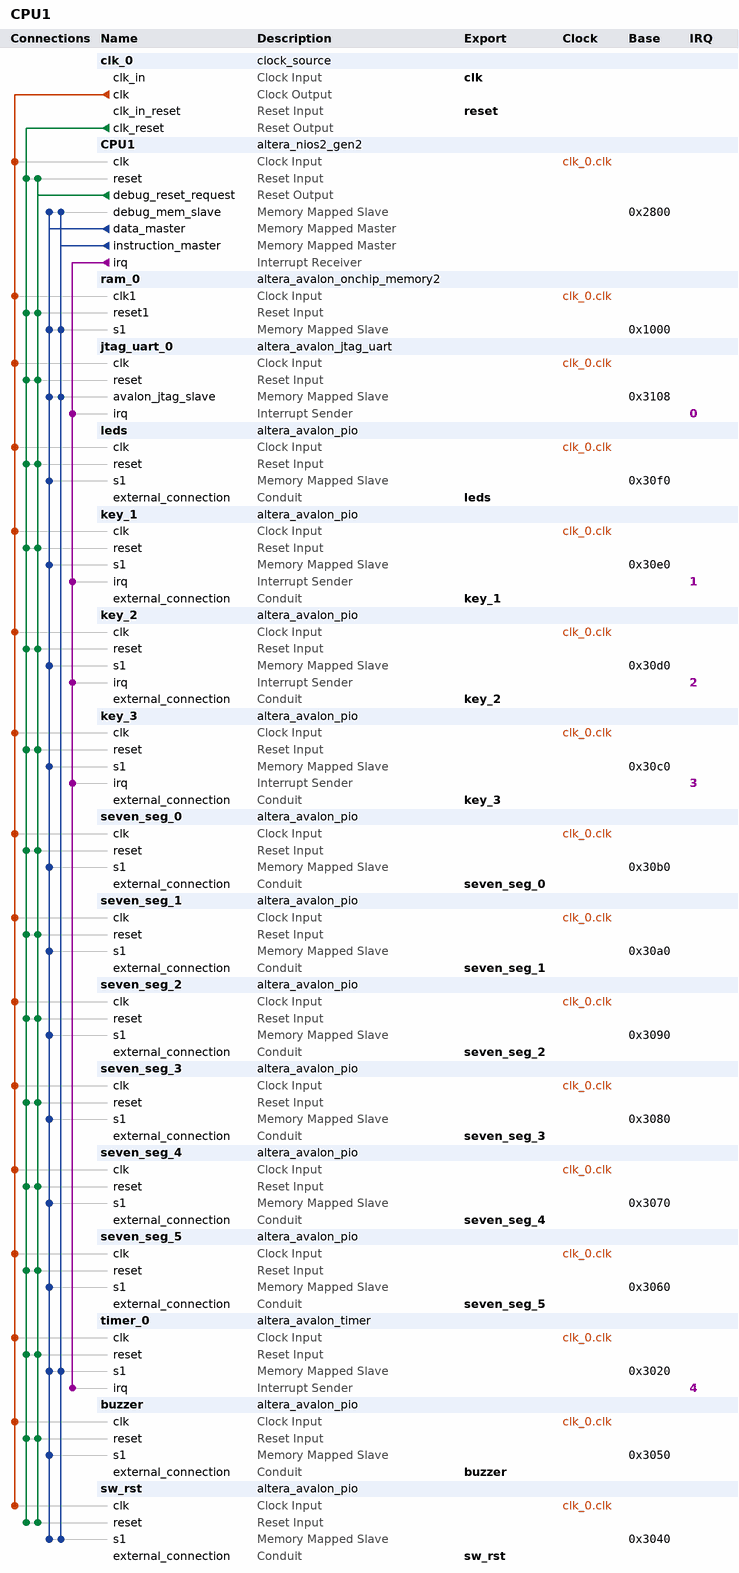
[diagram p0: system contents]
# Platform Designer (Qsys) system CPU1, Cyclone V 5CSXFC6D6F31C6
# Parameters at their usual value, and those the tool derives, are not listed.
package require -exact qsys 18.1
create_system CPU1
set_project_property DEVICE_FAMILY {Cyclone V}
set_project_property DEVICE 5CSXFC6D6F31C6

add_instance clk_0 clock_source 18.1
set_instance_parameter_value clk_0 clockFrequency 50000000

add_instance CPU1 altera_nios2_gen2 18.1
set_instance_parameter_value CPU1 dcache_size 2048
set_instance_parameter_value CPU1 exceptionSlave ram_0.s1
set_instance_parameter_value CPU1 icache_size 4096
set_instance_parameter_value CPU1 impl Tiny
set_instance_parameter_value CPU1 resetSlave ram_0.s1

add_instance ram_0 altera_avalon_onchip_memory2 18.1
set_instance_parameter_value ram_0 dataWidth 32
set_instance_parameter_value ram_0 dualPort false
set_instance_parameter_value ram_0 initMemContent true
set_instance_parameter_value ram_0 initializationFileName onchip_mem.hex
set_instance_parameter_value ram_0 memorySize 4090

add_instance jtag_uart_0 altera_avalon_jtag_uart 18.1
set_instance_parameter_value jtag_uart_0 simInteractiveOptions NO_INTERACTIVE_WINDOWS

add_instance leds altera_avalon_pio 18.1
set_instance_parameter_value leds direction Output
set_instance_parameter_value leds width 10

add_instance key_1 altera_avalon_pio 18.1
set_instance_parameter_value key_1 captureEdge true
set_instance_parameter_value key_1 direction Input
set_instance_parameter_value key_1 edgeType FALLING
set_instance_parameter_value key_1 generateIRQ true
set_instance_parameter_value key_1 width 1

add_instance key_2 altera_avalon_pio 18.1
set_instance_parameter_value key_2 captureEdge true
set_instance_parameter_value key_2 direction Input
set_instance_parameter_value key_2 edgeType FALLING
set_instance_parameter_value key_2 generateIRQ true
set_instance_parameter_value key_2 width 1

add_instance key_3 altera_avalon_pio 18.1
set_instance_parameter_value key_3 captureEdge true
set_instance_parameter_value key_3 direction Input
set_instance_parameter_value key_3 edgeType FALLING
set_instance_parameter_value key_3 generateIRQ true
set_instance_parameter_value key_3 width 1

add_instance seven_seg_0 altera_avalon_pio 18.1
set_instance_parameter_value seven_seg_0 direction Output
set_instance_parameter_value seven_seg_0 width 7

add_instance seven_seg_1 altera_avalon_pio 18.1
set_instance_parameter_value seven_seg_1 direction Output
set_instance_parameter_value seven_seg_1 width 7

add_instance seven_seg_2 altera_avalon_pio 18.1
set_instance_parameter_value seven_seg_2 direction Output
set_instance_parameter_value seven_seg_2 width 7

add_instance seven_seg_3 altera_avalon_pio 18.1
set_instance_parameter_value seven_seg_3 direction Output
set_instance_parameter_value seven_seg_3 width 7

add_instance seven_seg_4 altera_avalon_pio 18.1
set_instance_parameter_value seven_seg_4 direction Output
set_instance_parameter_value seven_seg_4 width 7

add_instance seven_seg_5 altera_avalon_pio 18.1
set_instance_parameter_value seven_seg_5 direction Output
set_instance_parameter_value seven_seg_5 width 7

add_instance timer_0 altera_avalon_timer 18.1
set_instance_parameter_value timer_0 alwaysRun true
set_instance_parameter_value timer_0 fixedPeriod true
set_instance_parameter_value timer_0 period 1
set_instance_parameter_value timer_0 periodUnits MSEC
set_instance_parameter_value timer_0 snapshot false

add_instance buzzer altera_avalon_pio 18.1
set_instance_parameter_value buzzer direction Output
set_instance_parameter_value buzzer width 1

add_instance sw_rst altera_avalon_pio 18.1
set_instance_parameter_value sw_rst direction Input
set_instance_parameter_value sw_rst width 1

# connections
add_connection clk_0.clk buzzer.clk clock
add_connection clk_0.clk CPU1.clk clock
add_connection clk_0.clk jtag_uart_0.clk clock
add_connection clk_0.clk key_1.clk clock
add_connection clk_0.clk key_2.clk clock
add_connection clk_0.clk key_3.clk clock
add_connection clk_0.clk leds.clk clock
add_connection clk_0.clk ram_0.clk1 clock
add_connection clk_0.clk seven_seg_0.clk clock
add_connection clk_0.clk seven_seg_1.clk clock
add_connection clk_0.clk seven_seg_2.clk clock
add_connection clk_0.clk seven_seg_3.clk clock
add_connection clk_0.clk seven_seg_4.clk clock
add_connection clk_0.clk seven_seg_5.clk clock
add_connection clk_0.clk sw_rst.clk clock
add_connection clk_0.clk timer_0.clk clock
add_connection clk_0.clk_reset buzzer.reset reset
add_connection clk_0.clk_reset CPU1.reset reset
add_connection clk_0.clk_reset jtag_uart_0.reset reset
add_connection clk_0.clk_reset key_1.reset reset
add_connection clk_0.clk_reset key_2.reset reset
add_connection clk_0.clk_reset key_3.reset reset
add_connection clk_0.clk_reset leds.reset reset
add_connection clk_0.clk_reset ram_0.reset1 reset
add_connection clk_0.clk_reset seven_seg_0.reset reset
add_connection clk_0.clk_reset seven_seg_1.reset reset
add_connection clk_0.clk_reset seven_seg_2.reset reset
add_connection clk_0.clk_reset seven_seg_3.reset reset
add_connection clk_0.clk_reset seven_seg_4.reset reset
add_connection clk_0.clk_reset seven_seg_5.reset reset
add_connection clk_0.clk_reset sw_rst.reset reset
add_connection clk_0.clk_reset timer_0.reset reset
add_connection CPU1.debug_reset_request buzzer.reset reset
add_connection CPU1.debug_reset_request CPU1.reset reset
add_connection CPU1.debug_reset_request jtag_uart_0.reset reset
add_connection CPU1.debug_reset_request key_1.reset reset
add_connection CPU1.debug_reset_request key_2.reset reset
add_connection CPU1.debug_reset_request key_3.reset reset
add_connection CPU1.debug_reset_request leds.reset reset
add_connection CPU1.debug_reset_request ram_0.reset1 reset
add_connection CPU1.debug_reset_request seven_seg_0.reset reset
add_connection CPU1.debug_reset_request seven_seg_1.reset reset
add_connection CPU1.debug_reset_request seven_seg_2.reset reset
add_connection CPU1.debug_reset_request seven_seg_3.reset reset
add_connection CPU1.debug_reset_request seven_seg_4.reset reset
add_connection CPU1.debug_reset_request seven_seg_5.reset reset
add_connection CPU1.debug_reset_request sw_rst.reset reset
add_connection CPU1.debug_reset_request timer_0.reset reset
add_connection CPU1.data_master buzzer.s1 avalon
set_connection_parameter_value CPU1.data_master/buzzer.s1 baseAddress 0x3050
add_connection CPU1.data_master CPU1.debug_mem_slave avalon
set_connection_parameter_value CPU1.data_master/CPU1.debug_mem_slave baseAddress 0x2800
add_connection CPU1.data_master jtag_uart_0.avalon_jtag_slave avalon
set_connection_parameter_value CPU1.data_master/jtag_uart_0.avalon_jtag_slave baseAddress 0x3108
add_connection CPU1.data_master key_1.s1 avalon
set_connection_parameter_value CPU1.data_master/key_1.s1 baseAddress 0x30e0
add_connection CPU1.data_master key_2.s1 avalon
set_connection_parameter_value CPU1.data_master/key_2.s1 baseAddress 0x30d0
add_connection CPU1.data_master key_3.s1 avalon
set_connection_parameter_value CPU1.data_master/key_3.s1 baseAddress 0x30c0
add_connection CPU1.data_master leds.s1 avalon
set_connection_parameter_value CPU1.data_master/leds.s1 baseAddress 0x30f0
add_connection CPU1.data_master ram_0.s1 avalon
set_connection_parameter_value CPU1.data_master/ram_0.s1 baseAddress 0x1000
add_connection CPU1.data_master seven_seg_0.s1 avalon
set_connection_parameter_value CPU1.data_master/seven_seg_0.s1 baseAddress 0x30b0
add_connection CPU1.data_master seven_seg_1.s1 avalon
set_connection_parameter_value CPU1.data_master/seven_seg_1.s1 baseAddress 0x30a0
add_connection CPU1.data_master seven_seg_2.s1 avalon
set_connection_parameter_value CPU1.data_master/seven_seg_2.s1 baseAddress 0x3090
add_connection CPU1.data_master seven_seg_3.s1 avalon
set_connection_parameter_value CPU1.data_master/seven_seg_3.s1 baseAddress 0x3080
add_connection CPU1.data_master seven_seg_4.s1 avalon
set_connection_parameter_value CPU1.data_master/seven_seg_4.s1 baseAddress 0x3070
add_connection CPU1.data_master seven_seg_5.s1 avalon
set_connection_parameter_value CPU1.data_master/seven_seg_5.s1 baseAddress 0x3060
add_connection CPU1.data_master sw_rst.s1 avalon
set_connection_parameter_value CPU1.data_master/sw_rst.s1 baseAddress 0x3040
add_connection CPU1.data_master timer_0.s1 avalon
set_connection_parameter_value CPU1.data_master/timer_0.s1 baseAddress 0x3020
add_connection CPU1.instruction_master CPU1.debug_mem_slave avalon
set_connection_parameter_value CPU1.instruction_master/CPU1.debug_mem_slave baseAddress 0x2800
add_connection CPU1.instruction_master jtag_uart_0.avalon_jtag_slave avalon
set_connection_parameter_value CPU1.instruction_master/jtag_uart_0.avalon_jtag_slave baseAddress 0x3108
add_connection CPU1.instruction_master ram_0.s1 avalon
set_connection_parameter_value CPU1.instruction_master/ram_0.s1 baseAddress 0x1000
add_connection CPU1.instruction_master sw_rst.s1 avalon
set_connection_parameter_value CPU1.instruction_master/sw_rst.s1 baseAddress 0x3040
add_connection CPU1.instruction_master timer_0.s1 avalon
set_connection_parameter_value CPU1.instruction_master/timer_0.s1 baseAddress 0x3020
add_connection CPU1.irq jtag_uart_0.irq interrupt
set_connection_parameter_value CPU1.irq/jtag_uart_0.irq irqNumber 0
add_connection CPU1.irq key_1.irq interrupt
set_connection_parameter_value CPU1.irq/key_1.irq irqNumber 1
add_connection CPU1.irq key_2.irq interrupt
set_connection_parameter_value CPU1.irq/key_2.irq irqNumber 2
add_connection CPU1.irq key_3.irq interrupt
set_connection_parameter_value CPU1.irq/key_3.irq irqNumber 3
add_connection CPU1.irq timer_0.irq interrupt
set_connection_parameter_value CPU1.irq/timer_0.irq irqNumber 4

# exported interfaces
add_interface buzzer conduit end
set_interface_property buzzer EXPORT_OF buzzer.external_connection
add_interface clk clock sink
set_interface_property clk EXPORT_OF clk_0.clk_in
add_interface key_1 conduit end
set_interface_property key_1 EXPORT_OF key_1.external_connection
add_interface key_2 conduit end
set_interface_property key_2 EXPORT_OF key_2.external_connection
add_interface key_3 conduit end
set_interface_property key_3 EXPORT_OF key_3.external_connection
add_interface leds conduit end
set_interface_property leds EXPORT_OF leds.external_connection
add_interface reset reset sink
set_interface_property reset EXPORT_OF clk_0.clk_in_reset
add_interface seven_seg_0 conduit end
set_interface_property seven_seg_0 EXPORT_OF seven_seg_0.external_connection
add_interface seven_seg_1 conduit end
set_interface_property seven_seg_1 EXPORT_OF seven_seg_1.external_connection
add_interface seven_seg_2 conduit end
set_interface_property seven_seg_2 EXPORT_OF seven_seg_2.external_connection
add_interface seven_seg_3 conduit end
set_interface_property seven_seg_3 EXPORT_OF seven_seg_3.external_connection
add_interface seven_seg_4 conduit end
set_interface_property seven_seg_4 EXPORT_OF seven_seg_4.external_connection
add_interface seven_seg_5 conduit end
set_interface_property seven_seg_5 EXPORT_OF seven_seg_5.external_connection
add_interface sw_rst conduit end
set_interface_property sw_rst EXPORT_OF sw_rst.external_connection

set_interconnect_requirement {$system} qsys_mm.clockCrossingAdapter HANDSHAKE
set_interconnect_requirement {$system} qsys_mm.enableEccProtection FALSE
set_interconnect_requirement {$system} qsys_mm.insertDefaultSlave FALSE
set_interconnect_requirement {$system} qsys_mm.maxAdditionalLatency 1

save_system CPU1.qsys
